# Altium schematic sheet Trepanat_Sensors_3.SchDoc
size 840 x 594 mm; DocumentNumber: ПРО 2018.001 Э3; SheetNumber: 6; Format: A1
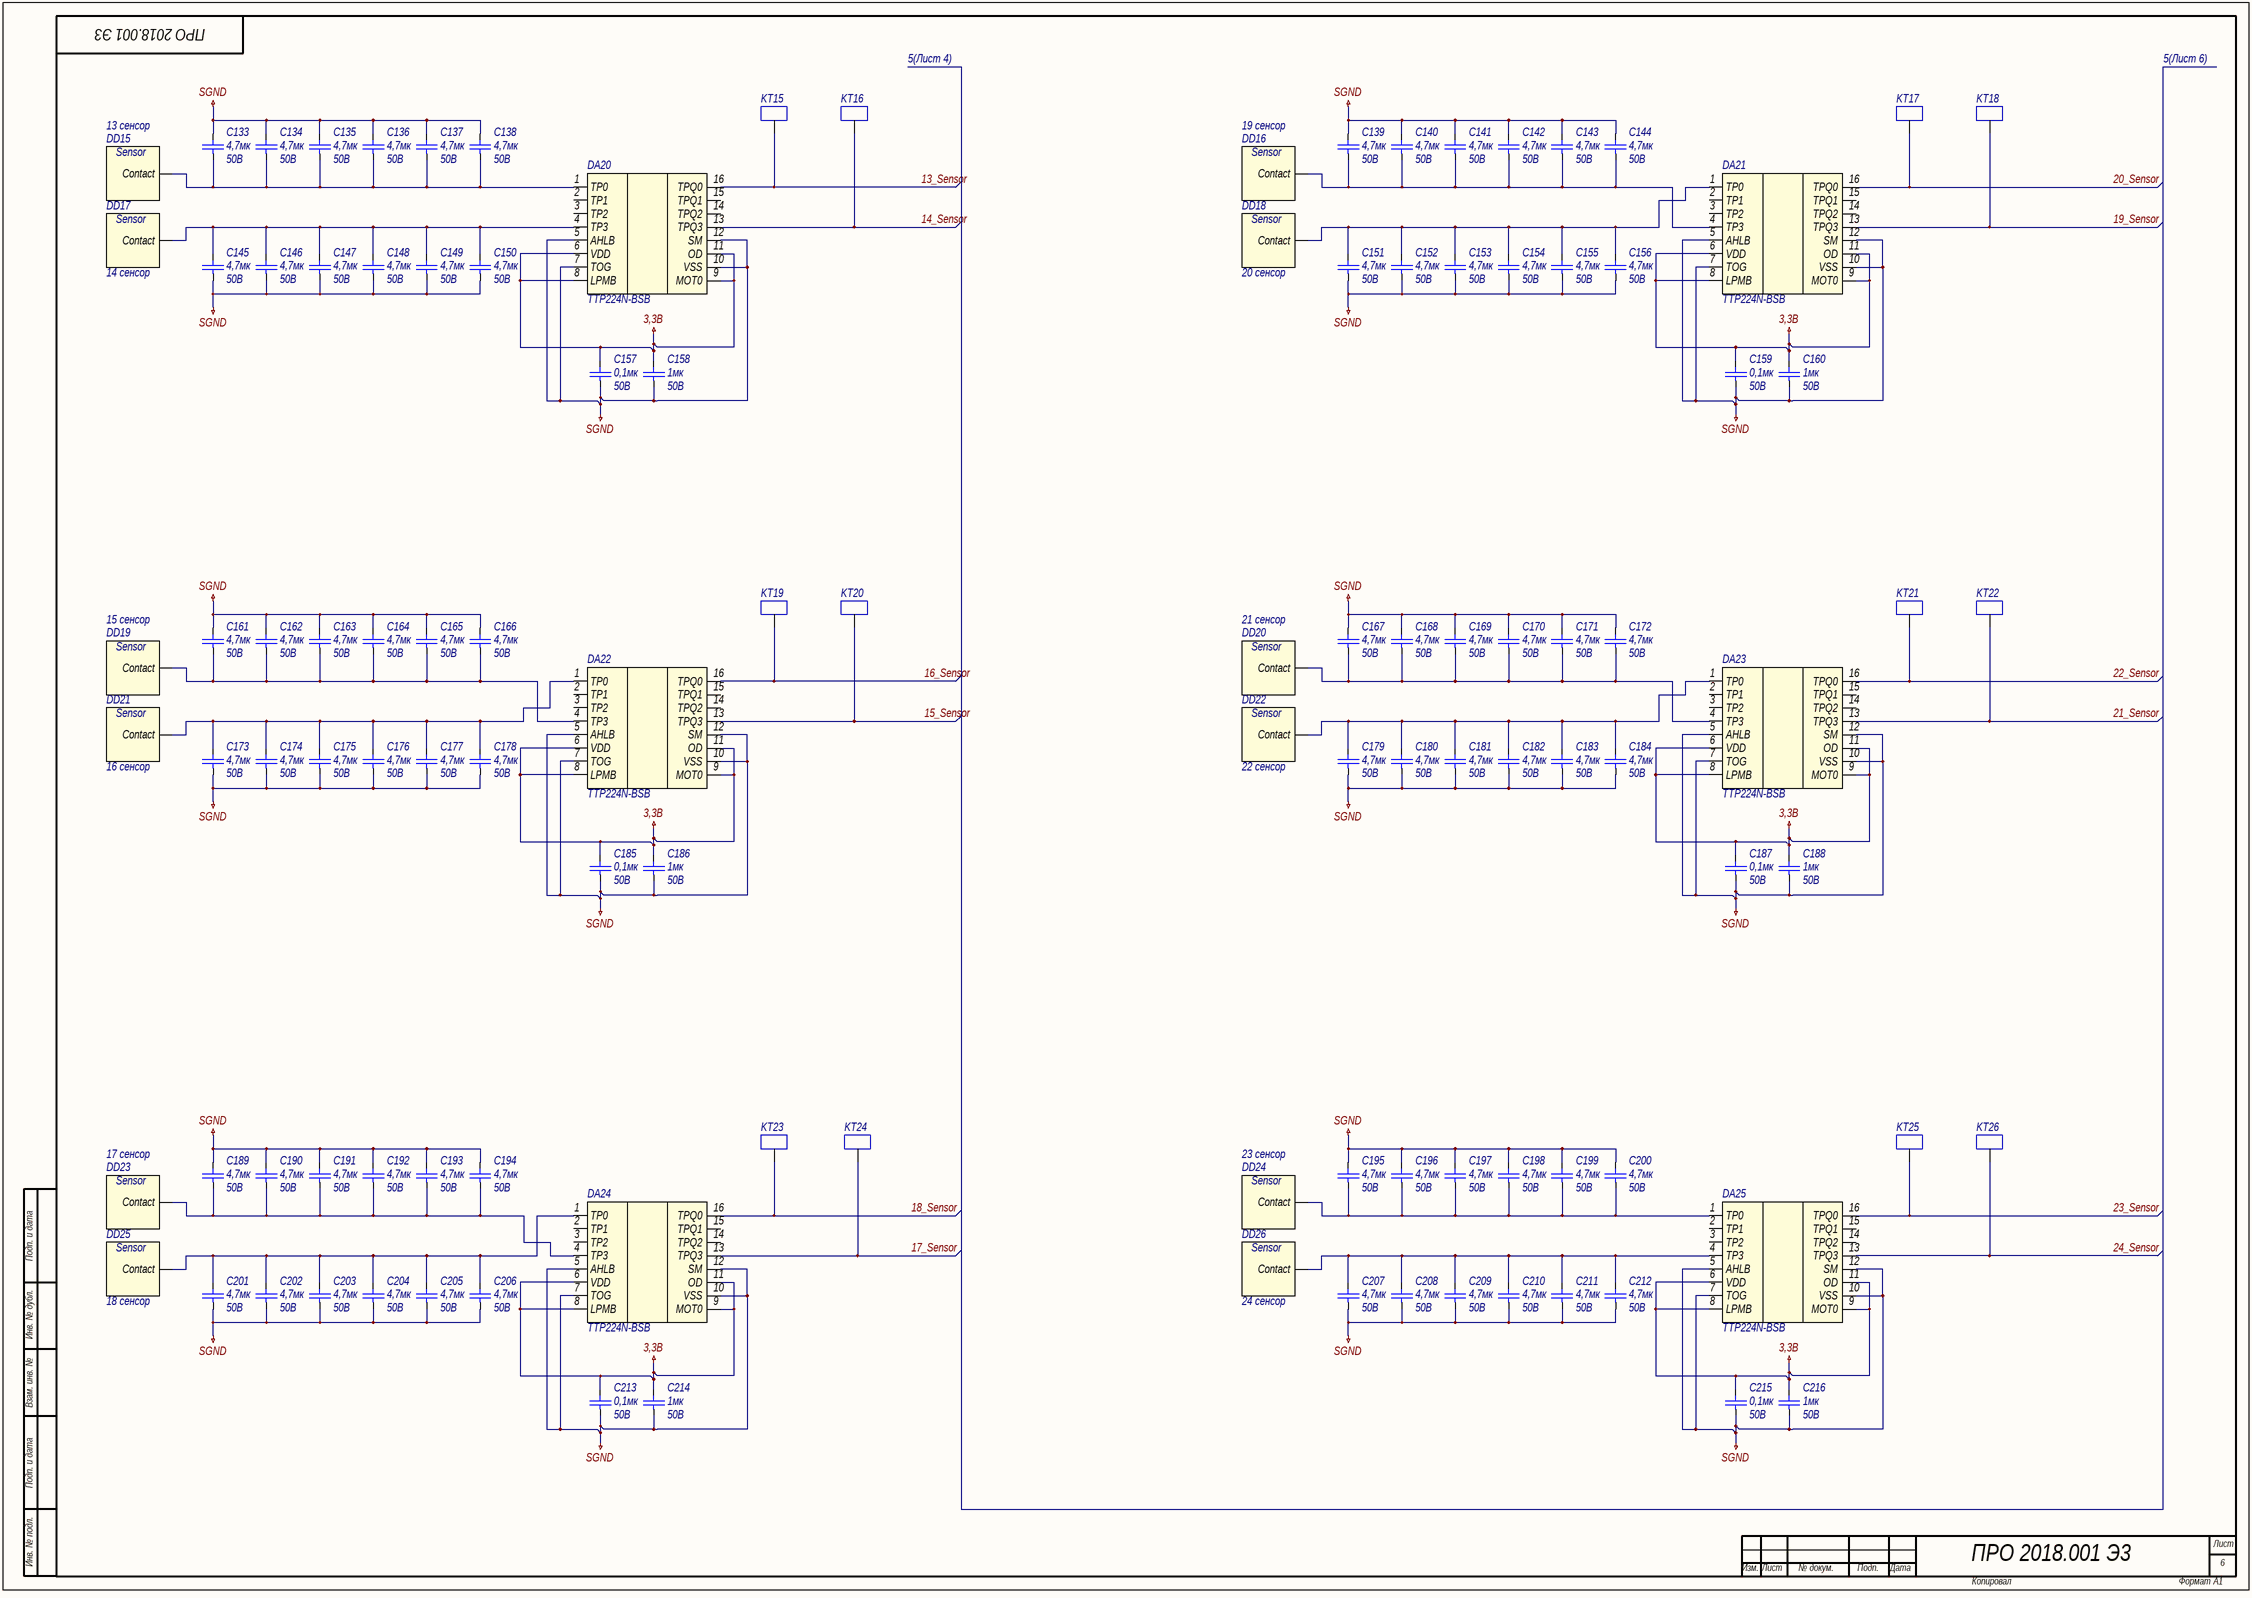
[diagram p0: Trepanat_Sensors_3.SchDoc]

## Parts
C133  4,7мк  Voltage: 50В  [C0805]
C134  4,7мк  Voltage: 50В  [C0805]
C135  4,7мк  Voltage: 50В  [C0805]
C136  4,7мк  Voltage: 50В  [C0805]
C137  4,7мк  Voltage: 50В  [C0805]
C138  4,7мк  Voltage: 50В  [C0805]
C139  4,7мк  Voltage: 50В  [C0805]
C140  4,7мк  Voltage: 50В  [C0805]
C141  4,7мк  Voltage: 50В  [C0805]
C142  4,7мк  Voltage: 50В  [C0805]
C143  4,7мк  Voltage: 50В  [C0805]
C144  4,7мк  Voltage: 50В  [C0805]
C145  4,7мк  Voltage: 50В  [C0805]
C146  4,7мк  Voltage: 50В  [C0805]
C147  4,7мк  Voltage: 50В  [C0805]
C148  4,7мк  Voltage: 50В  [C0805]
C149  4,7мк  Voltage: 50В  [C0805]
C150  4,7мк  Voltage: 50В  [C0805]
C151  4,7мк  Voltage: 50В  [C0805]
C152  4,7мк  Voltage: 50В  [C0805]
C153  4,7мк  Voltage: 50В  [C0805]
C154  4,7мк  Voltage: 50В  [C0805]
C155  4,7мк  Voltage: 50В  [C0805]
C156  4,7мк  Voltage: 50В  [C0805]
C157  0,1мк  Voltage: 50В  [C0805]
C158  1мк  Voltage: 50В  [C0805]
C159  0,1мк  Voltage: 50В  [C0805]
C160  1мк  Voltage: 50В  [C0805]
C161  4,7мк  Voltage: 50В  [C0805]
C162  4,7мк  Voltage: 50В  [C0805]
C163  4,7мк  Voltage: 50В  [C0805]
C164  4,7мк  Voltage: 50В  [C0805]
C165  4,7мк  Voltage: 50В  [C0805]
C166  4,7мк  Voltage: 50В  [C0805]
C167  4,7мк  Voltage: 50В  [C0805]
C168  4,7мк  Voltage: 50В  [C0805]
C169  4,7мк  Voltage: 50В  [C0805]
C170  4,7мк  Voltage: 50В  [C0805]
C171  4,7мк  Voltage: 50В  [C0805]
C172  4,7мк  Voltage: 50В  [C0805]
C173  4,7мк  Voltage: 50В  [C0805]
C174  4,7мк  Voltage: 50В  [C0805]
C175  4,7мк  Voltage: 50В  [C0805]
C176  4,7мк  Voltage: 50В  [C0805]
C177  4,7мк  Voltage: 50В  [C0805]
C178  4,7мк  Voltage: 50В  [C0805]
C179  4,7мк  Voltage: 50В  [C0805]
C180  4,7мк  Voltage: 50В  [C0805]
C181  4,7мк  Voltage: 50В  [C0805]
C182  4,7мк  Voltage: 50В  [C0805]
C183  4,7мк  Voltage: 50В  [C0805]
C184  4,7мк  Voltage: 50В  [C0805]
C185  0,1мк  Voltage: 50В  [C0805]
C186  1мк  Voltage: 50В  [C0805]
C187  0,1мк  Voltage: 50В  [C0805]
C188  1мк  Voltage: 50В  [C0805]
C189  4,7мк  Voltage: 50В  [C0805]
C190  4,7мк  Voltage: 50В  [C0805]
C191  4,7мк  Voltage: 50В  [C0805]
C192  4,7мк  Voltage: 50В  [C0805]
C193  4,7мк  Voltage: 50В  [C0805]
C194  4,7мк  Voltage: 50В  [C0805]
C195  4,7мк  Voltage: 50В  [C0805]
C196  4,7мк  Voltage: 50В  [C0805]
C197  4,7мк  Voltage: 50В  [C0805]
C198  4,7мк  Voltage: 50В  [C0805]
C199  4,7мк  Voltage: 50В  [C0805]
C200  4,7мк  Voltage: 50В  [C0805]
C201  4,7мк  Voltage: 50В  [C0805]
C202  4,7мк  Voltage: 50В  [C0805]
C203  4,7мк  Voltage: 50В  [C0805]
C204  4,7мк  Voltage: 50В  [C0805]
C205  4,7мк  Voltage: 50В  [C0805]
C206  4,7мк  Voltage: 50В  [C0805]
C207  4,7мк  Voltage: 50В  [C0805]
C208  4,7мк  Voltage: 50В  [C0805]
C209  4,7мк  Voltage: 50В  [C0805]
C210  4,7мк  Voltage: 50В  [C0805]
C211  4,7мк  Voltage: 50В  [C0805]
C212  4,7мк  Voltage: 50В  [C0805]
C213  0,1мк  Voltage: 50В  [C0805]
C214  1мк  Voltage: 50В  [C0805]
C215  0,1мк  Voltage: 50В  [C0805]
C216  1мк  Voltage: 50В  [C0805]
DA20  TTP224N-BSB  [SSOP16]
DA21  TTP224N-BSB  [SSOP16]
DA22  TTP224N-BSB  [SSOP16]
DA23  TTP224N-BSB  [SSOP16]
DA24  TTP224N-BSB  [SSOP16]
DA25  TTP224N-BSB  [SSOP16]
DD15  13 сенсор  [SENSOR]
DD16  19 сенсор  [SENSOR]
DD17  14 сенсор  [SENSOR]
DD18  20 сенсор  [SENSOR]
DD19  15 сенсор  [SENSOR]
DD20  21 сенсор  [SENSOR]
DD21  16 сенсор  [SENSOR]
DD22  22 сенсор  [SENSOR]
DD23  17 сенсор  [SENSOR]
DD24  23 сенсор  [SENSOR]
DD25  18 сенсор  [SENSOR]
DD26  24 сенсор  [SENSOR]
KT15  KT  [КТ]  (value not drawn)
KT16  KT  [КТ]  (value not drawn)
KT17  KT  [КТ]  (value not drawn)
KT18  KT  [КТ]  (value not drawn)
KT19  KT  [КТ]  (value not drawn)
KT20  KT  [КТ]  (value not drawn)
KT21  KT  [КТ]  (value not drawn)
KT22  KT  [КТ]  (value not drawn)
KT23  KT  [КТ]  (value not drawn)
KT24  KT  [КТ]  (value not drawn)
KT25  KT  [КТ]  (value not drawn)
KT26  KT  [КТ]  (value not drawn)

## Nets
3,3B: C157.2 C158.2 C159.2 C160.2 C185.2 C186.2 C187.2 C188.2 C213.2 C214.2 C215.2 C216.2 DA20.6(VDD) DA20.8(LPMB) DA20.9(MOT0) DA20.11(OD) DA21.6(VDD) DA21.8(LPMB) DA21.9(MOT0) DA21.11(OD) DA22.6(VDD) DA22.8(LPMB) DA22.9(MOT0) DA22.11(OD) DA23.6(VDD) DA23.8(LPMB) DA23.9(MOT0) DA23.11(OD) DA24.6(VDD) DA24.8(LPMB) DA24.9(MOT0) DA24.11(OD) DA25.6(VDD) DA25.8(LPMB) DA25.9(MOT0) DA25.11(OD)
SGND: C133.2 C134.2 C135.2 C136.2 C137.2 C138.2 C139.2 C140.2 C141.2 C142.2 C143.2 C144.2 C145.1 C146.1 C147.1 C148.1 C149.1 C150.1 C151.1 C152.1 C153.1 C154.1 C155.1 C156.1 C157.1 C158.1 C159.1 C160.1 C161.2 C162.2 C163.2 C164.2 C165.2 C166.2 C167.2 C168.2 C169.2 C170.2 C171.2 C172.2 C173.1 C174.1 C175.1 C176.1 C177.1 C178.1 C179.1 C180.1 C181.1 C182.1 C183.1 C184.1 C185.1 C186.1 C187.1 C188.1 C189.2 C190.2 C191.2 C192.2 C193.2 C194.2 C195.2 C196.2 C197.2 C198.2 C199.2 C200.2 C201.1 C202.1 C203.1 C204.1 C205.1 C206.1 C207.1 C208.1 C209.1 C210.1 C211.1 C212.1 C213.1 C214.1 C215.1 C216.1 DA20.5(AHLB) DA20.7(TOG) DA20.10(VSS) DA20.12(SM) DA21.5(AHLB) DA21.7(TOG) DA21.10(VSS) DA21.12(SM) DA22.5(AHLB) DA22.7(TOG) DA22.10(VSS) DA22.12(SM) DA23.5(AHLB) DA23.7(TOG) DA23.10(VSS) DA23.12(SM) DA24.5(AHLB) DA24.7(TOG) DA24.10(VSS) DA24.12(SM) DA25.5(AHLB) DA25.7(TOG) DA25.10(VSS) DA25.12(SM)
13_Sensor: DA20.16(TPQ0) KT15.1
14_Sensor: DA20.13(TPQ3) KT16.1
15_Sensor: DA22.13(TPQ3) KT20.1
16_Sensor: DA22.16(TPQ0) KT19.1
17_Sensor: DA24.13(TPQ3) KT24.1
18_Sensor: DA24.16(TPQ0) KT23.1
19_Sensor: DA21.13(TPQ3) KT18.1
20_Sensor: DA21.16(TPQ0) KT17.1
21_Sensor: DA23.13(TPQ3) KT22.1
22_Sensor: DA23.16(TPQ0) KT21.1
23_Sensor: DA25.16(TPQ0) KT25.1
24_Sensor: DA25.13(TPQ3) KT26.1
NetC133_1: C133.1 C134.1 C135.1 C136.1 C137.1 C138.1 DA20.1(TP0) DD15.1(Contact)
NetC139_1: C139.1 C140.1 C141.1 C142.1 C143.1 C144.1 DA21.4(TP3) DD16.1(Contact)
NetC145_2: C145.2 C146.2 C147.2 C148.2 C149.2 C150.2 DA20.4(TP3) DD17.1(Contact)
NetC151_2: C151.2 C152.2 C153.2 C154.2 C155.2 C156.2 DA21.1(TP0) DD18.1(Contact)
NetC161_1: C161.1 C162.1 C163.1 C164.1 C165.1 C166.1 DA22.4(TP3) DD19.1(Contact)
NetC167_1: C167.1 C168.1 C169.1 C170.1 C171.1 C172.1 DA23.4(TP3) DD20.1(Contact)
NetC173_2: C173.2 C174.2 C175.2 C176.2 C177.2 C178.2 DA22.1(TP0) DD21.1(Contact)
NetC179_2: C179.2 C180.2 C181.2 C182.2 C183.2 C184.2 DA23.1(TP0) DD22.1(Contact)
NetC189_1: C189.1 C190.1 C191.1 C192.1 C193.1 C194.1 DA24.4(TP3) DD23.1(Contact)
NetC195_1: C195.1 C196.1 C197.1 C198.1 C199.1 C200.1 DA25.1(TP0) DD24.1(Contact)
NetC201_2: C201.2 C202.2 C203.2 C204.2 C205.2 C206.2 DA24.1(TP0) DD25.1(Contact)
NetC207_2: C207.2 C208.2 C209.2 C210.2 C211.2 C212.2 DA25.4(TP3) DD26.1(Contact)

Not connected (* = marked no-connect by the designer): DA20 2(TP1) 3(TP2) 14(TPQ2) 15(TPQ1); DA21 2(TP1) 3(TP2) 14(TPQ2) 15(TPQ1); DA22 2(TP1) 3(TP2) 14(TPQ2) 15(TPQ1); DA23 2(TP1) 3(TP2) 14(TPQ2) 15(TPQ1); DA24 2(TP1) 3(TP2) 14(TPQ2) 15(TPQ1); DA25 2(TP1) 3(TP2) 14(TPQ2) 15(TPQ1)

## Notes on the sheet
- 5(Лист 4)
- 5(Лист 6)
- Подп. и дата
- Инв. № дубл.
- Взам. инв. №
- Инв. № подл.
- Лист
- Изм.
- № докум.
- Подп.
- Дата
- Копировал
- Формат

## Library data of the parts
C133-C216 = Capacitor: Конденсатор
  C133-C156 C161-C184 C189-C212: Value: 4,7мк
  C157 C159 C185 C187 C213 C215: Value: 0,1мк
  C158 C160 C186 C188 C214 C216: Value: 1мк
DA20-DA25 = TTP224N-BSB: 4 keys Touch Pad Detector IC; Name: TTP224N-BSB
DD15-DD26 = Sensor: Сенсорная площадка
  DD15: Name: 13 сенсор
  DD16: Name: 19 сенсор
  DD17: Name: 14 сенсор
  DD18: Name: 20 сенсор
  DD19: Name: 15 сенсор
  DD20: Name: 21 сенсор
  DD21: Name: 16 сенсор
  DD22: Name: 22 сенсор
  DD23: Name: 17 сенсор
  DD24: Name: 23 сенсор
  DD25: Name: 18 сенсор
  DD26: Name: 24 сенсор
KT15-KT26 = KT: Контрольная точка